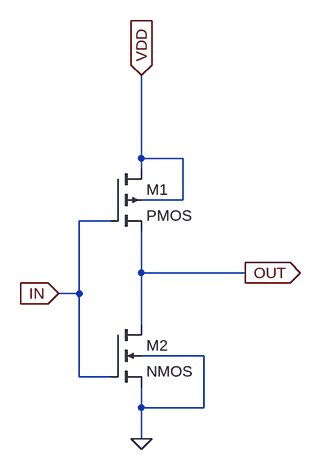
[diagram p0: schematic NOT1.asc]
NOT1.asc, the LTspice schematic file:
Version 4.1
SHEET 1 880 680
WIRE 240 176 240 48
WIRE 304 176 240 176
WIRE 240 192 240 176
WIRE 304 240 304 176
WIRE 304 240 240 240
WIRE 192 272 144 272
WIRE 240 352 240 288
WIRE 400 352 240 352
WIRE 144 384 144 272
WIRE 144 384 112 384
WIRE 240 432 240 352
WIRE 336 480 240 480
WIRE 144 512 144 384
WIRE 192 512 144 512
WIRE 240 560 240 528
WIRE 336 560 336 480
WIRE 336 560 240 560
WIRE 240 608 240 560
FLAG 240 608 0
FLAG 112 384 IN
IOPIN 112 384 In
FLAG 400 352 OUT
IOPIN 400 352 Out
FLAG 240 48 VDD
IOPIN 240 48 In
SYMBOL pmos4 192 192 R0
SYMATTR InstName M1
SYMBOL nmos4 192 432 R0
SYMATTR InstName M2

The netlist it stands for:
* NOT1.asc
M1 VDD IN OUT VDD PMOS
M2 OUT IN 0 0 NMOS
.model NMOS NMOS
.model PMOS PMOS
.lib standard.mos
.backanno
.end